# Altium schematic sheet MCU_System.SchDoc: MCU System
size A4; DrawnBy: Alvin Ha; DocumentNumber: MCU2018-1; Revision: 2.0; SheetNumber: 1; SheetTotal: 4
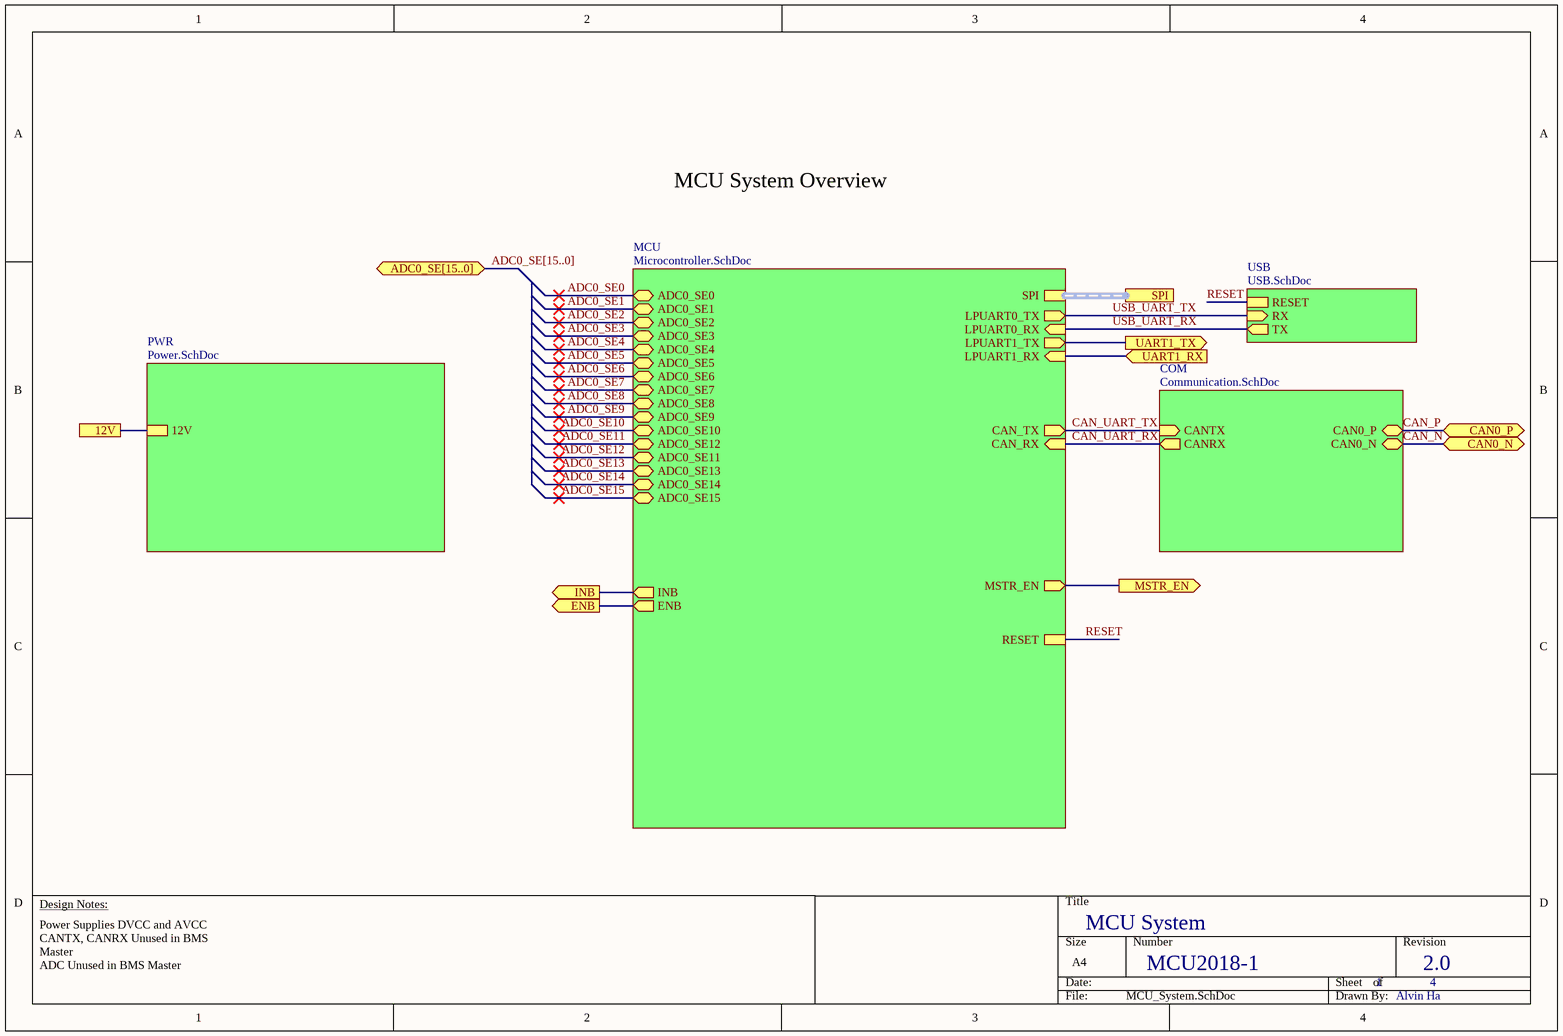
[diagram p0: MCU_System.SchDoc]

## Sub-sheets
COM = Communication.SchDoc: CAN0_P (bidir), CAN0_N (bidir), CANRX (out), CANTX (in)
MCU = Microcontroller.SchDoc: ADC0_SE3 (bidir), ADC0_SE6 (bidir), ADC0_SE4 (bidir), ADC0_SE1 (bidir), ADC0_SE13 (bidir), ADC0_SE7 (bidir), ADC0_SE5 (bidir), ADC0_SE14 (bidir), ADC0_SE12 (bidir), SPI (harness SPI), ADC0_SE2 (bidir), ADC0_SE0 (bidir), ADC0_SE11 (bidir), ADC0_SE15 (bidir), ADC0_SE8 (bidir), ADC0_SE10 (bidir), ADC0_SE9 (bidir), CAN_RX (in), CAN_TX (out), LPUART0_TX (out), LPUART0_RX (in), MSTR_EN (out), ENB (out), INB (out), LPUART1_TX (out), LPUART1_RX (in), RESET
PWR = Power.SchDoc: 12V
USB = USB.SchDoc: RESET, RX (in), TX (out)

## Ports
12V, ADC0_SE[15..0] (bidir), CAN0_N (bidir), CAN0_P (bidir), ENB (out), INB (out), MSTR_EN (out), SPI (harness SPI), UART1_RX (in), UART1_TX (out)

## Nets
12V: port 12V, sheet PWR/12V
ADC0_SE0: sheet MCU/ADC0_SE0
ADC0_SE1: sheet MCU/ADC0_SE1
ADC0_SE2: sheet MCU/ADC0_SE2
ADC0_SE3: sheet MCU/ADC0_SE3
ADC0_SE4: sheet MCU/ADC0_SE4
ADC0_SE5: sheet MCU/ADC0_SE5
ADC0_SE6: sheet MCU/ADC0_SE6
ADC0_SE7: sheet MCU/ADC0_SE7
ADC0_SE8: sheet MCU/ADC0_SE8
ADC0_SE9: sheet MCU/ADC0_SE9
ADC0_SE10: sheet MCU/ADC0_SE10
ADC0_SE11: sheet MCU/ADC0_SE12
ADC0_SE12: sheet MCU/ADC0_SE11
ADC0_SE13: sheet MCU/ADC0_SE13
ADC0_SE14: sheet MCU/ADC0_SE14
ADC0_SE15: sheet MCU/ADC0_SE15
CAN_N: port CAN0_N, sheet COM/CAN0_N
CAN_P: port CAN0_P, sheet COM/CAN0_P
CAN_UART_RX: sheet MCU/CAN_RX, sheet COM/CANRX
CAN_UART_TX: sheet MCU/CAN_TX, sheet COM/CANTX
ENB: port ENB, sheet MCU/ENB
INB: port INB, sheet MCU/INB
MSTR_EN: port MSTR_EN, sheet MCU/MSTR_EN
RESET: sheet MCU/RESET, sheet USB/RESET
UART1_RX: port UART1_RX, sheet MCU/LPUART1_RX
UART1_TX: port UART1_TX, sheet MCU/LPUART1_TX
USB_UART_RX: sheet MCU/LPUART0_RX, sheet USB/TX
USB_UART_TX: sheet MCU/LPUART0_TX, sheet USB/RX

## Buses and harness runs
bus ADC0_SE[15..0] = port ADC0_SE[15..0]
harness port SPI = sheet MCU/SPI

## Notes on the sheet
- MCU System Overview
- Design Notes:
- Power Supplies DVCC and AVCC
  CANTX, CANRX Unused in BMS Master
  ADC Unused in BMS Master